# EAGLE design encoder-hex-trigg (EAGLE 9.6.2)
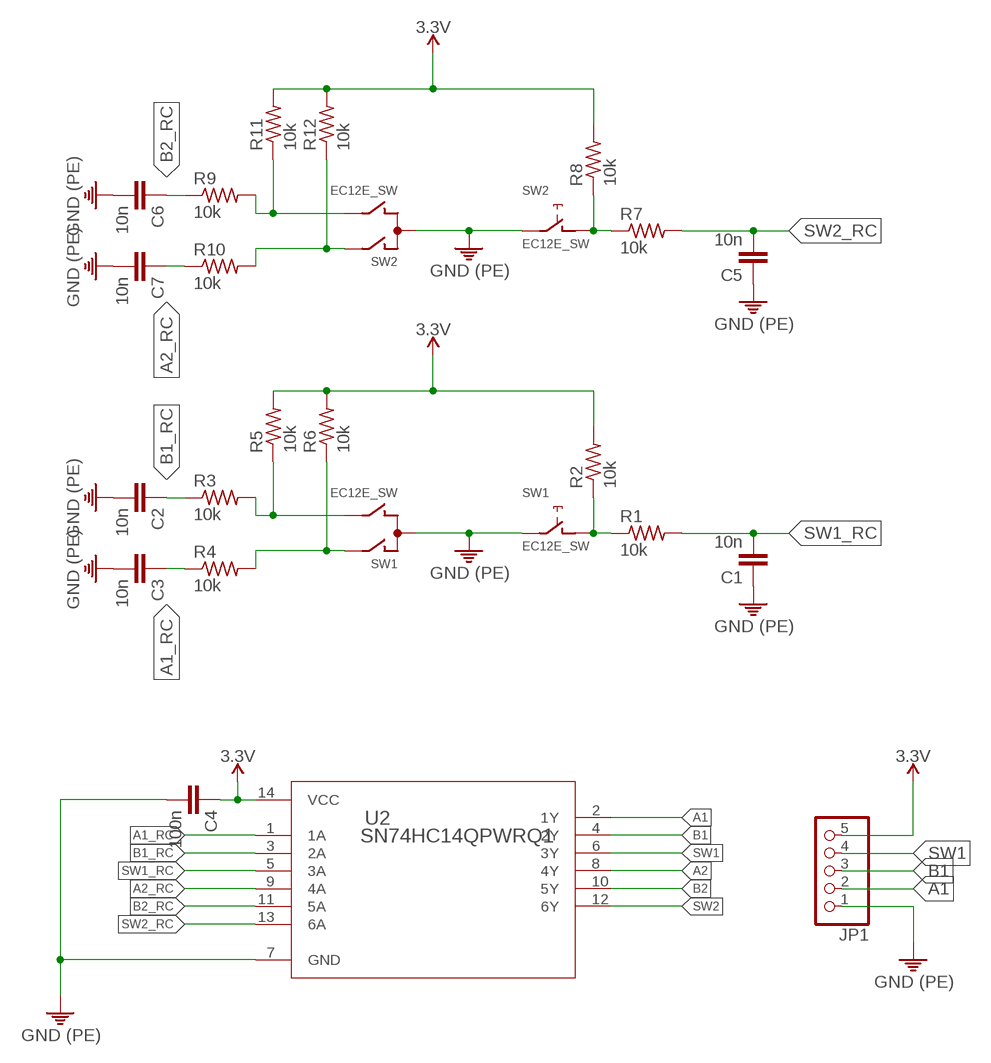
[diagram p0: schematic, sheet 1]

## Parts
C1  10n  C-EUC0603  [C0603]
C2  10n  C-EUC0603  [C0603]
C3  10n  C-EUC0603  [C0603]
C4  100n  C-EUC0603  [C0603]
C5  10n  C-EUC0603  [C0603]
C6  10n  C-EUC0603  [C0603]
C7  10n  C-EUC0603  [C0603]
JP1  PINHD-1X5  [1X05]
R1  10k  R-US_R0603  [R0603]
R2  10k  R-US_R0603  [R0603]
R3  10k  R-US_R0603  [R0603]
R4  10k  R-US_R0603  [R0603]
R5  10k  R-US_R0603  [R0603]
R6  10k  R-US_R0603  [R0603]
R7  10k  R-US_R0603  [R0603]
R8  10k  R-US_R0603  [R0603]
R9  10k  R-US_R0603  [R0603]
R10  10k  R-US_R0603  [R0603]
R11  10k  R-US_R0603  [R0603]
R12  10k  R-US_R0603  [R0603]
SW1  EC12E_SW  [ALPS_EC12E_SW]
SW2  EC12E_SW  [ALPS_EC12E_SW]
U2  SN74HC14QPWRQ1  [PW14]

## Nets
3.3V: C4.1 JP1.5 R2.2 R5.2 R6.2 R8.2 R11.2 R12.2 U2.14(VCC)
A1: JP1.2 U2.2(1Y)
A1_RC: C3.1 R4.1 U2.1(1A)
A2: U2.8(4Y)
A2_RC: C7.1 R10.1 U2.9(4A)
B1: JP1.3 U2.4(2Y)
B1_RC: C2.1 R3.1 U2.3(2A)
B2: U2.10(5Y)
B2_RC: C6.1 R9.1 U2.11(5A)
N$1: R1.1 R2.1 SW1.D
N$2: R7.1 R8.1 SW2.D
N$3: R3.2 R5.1 SW1.B
N$4: R4.2 R6.1 SW1.A
N$5: R9.2 R11.1 SW2.B
N$6: R10.2 R12.1 SW2.A
PE: C1.1 C2.2 C3.2 C4.2 C5.1 C6.2 C7.2 JP1.1 SW1.C SW1.E SW2.C SW2.E U2.7(GND) ; supply symbol labelled POWER-GND
SW1: JP1.4 U2.6(3Y)
SW1_RC: C1.2 R1.2 U2.5(3A)
SW2: U2.12(6Y)
SW2_RC: C5.2 R7.2 U2.13(6A)
Unconnected: SW1.GND1(G) SW1.GND2(G) SW2.GND1(G) SW2.GND2(G)

## Library data of the parts
C1-C7 = rcl:C-EU: CAPACITOR, European symbol; SPICEPREFIX: C
JP1 = pinhead:PINHD-1X5: PIN HEADER
R1-R12 = rcl:R-US_: RESISTOR, American symbol; SPICEPREFIX: R
SW1 SW2 = switch-alps:EC12E_SW: ALPS rotary Encoder EC12E series with switch; MPN: EC12E2424407; OC_FARNELL: 1520813; OC_NEWARK: 74M1068
U2 = SparkFun-PowerSymbols:SN74HC14QPWRQ1; COPYRIGHT: Copyright (C) 2022 Ultra Librarian. All rights reserved.; MANUFACTURER_PART_NUMBER: SN74HC14QPWRQ1; MFR_NAME: Texas Instruments

## Board
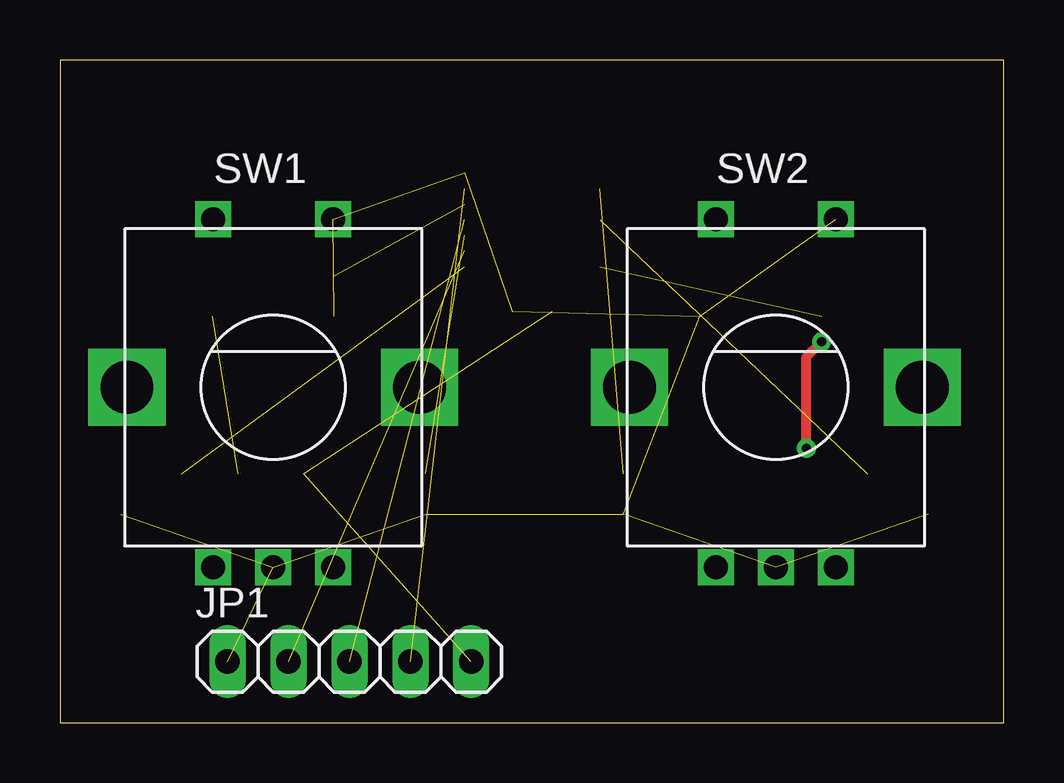
[diagram p1: board, top side]
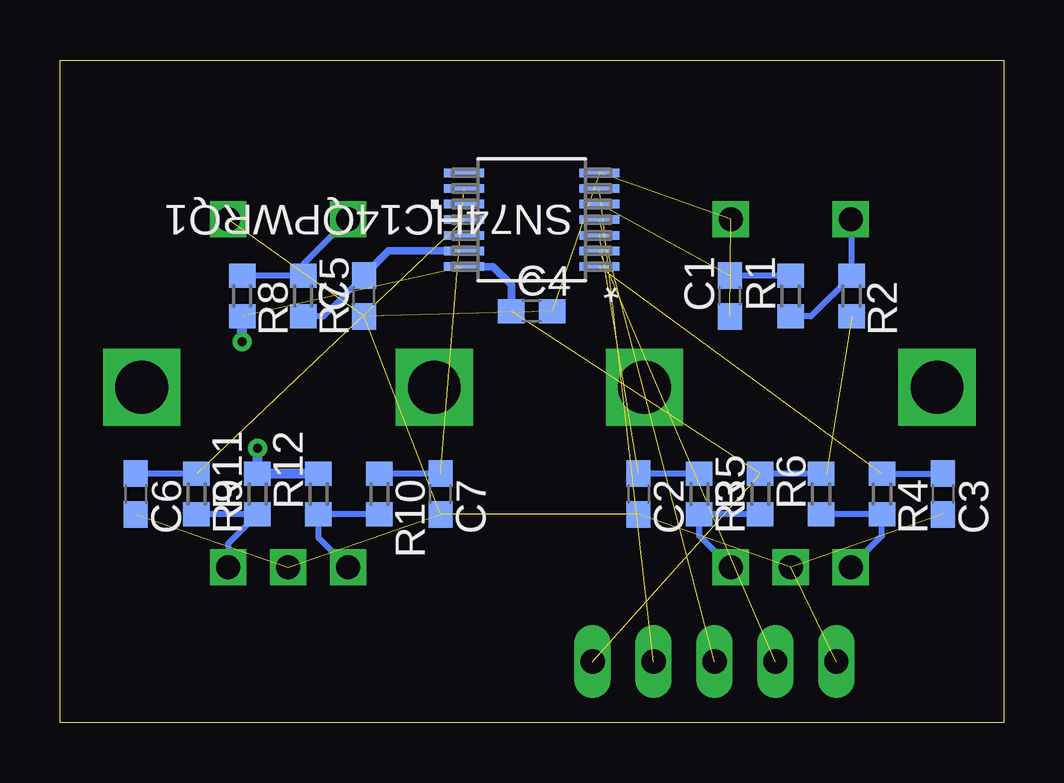
[diagram p2: board, bottom side, seen from below]

Size 39.35 x 27.61 mm. Coordinates in mm from the lower left corner, seen from the top.
Outline: 0,0 39.35,0 39.35,27.61 0,27.61 0,0
Copper layers (1*16): Top 0.035mm / dielectric 1.5mm / Bottom 0.035mm
Design rules "default": minimum track width 6mil, minimum drill 0.35mm, track to track 6mil, track to pad 6mil, pad to pad 6mil, via to via 6mil, smd to smd 6mil, copper to edge 40mil, drill to drill 6mil, minimum pad ring 10mil, minimum via ring 8mil, stop-mask expansion 4mil, vias tented up to drill 0mil, thermal gap 10mil

### Footprints (pad centres in the part's own frame; a part is rotated, then mirrored left to right if it is on the bottom)
C0603 = smd 1.1 x 1: 1 -0.85,0; 2 0.85,0
1X05 = drill 1.016 long: 1 -5.08,0; 2 -2.54,0; 3 0,0; 4 2.54,0; 5 5.08,0
R0603 = smd 1 x 1.1: 1 -0.85,0; 2 0.85,0
ALPS_EC12E_SW = drill 1 square: A -2.5,-7.5; B 2.5,-7.5; C 0,-7.5; D -2.5,7; E 2.5,7 | drill 2.2 square: GND1 -6.1,0; GND2 6.1,0
PW14 = smd 1.676 x 0.356: 1 -2.819,1.95; 2 -2.819,1.3; 3 -2.819,0.65; 4 -2.819,0; 5 -2.819,-0.65; 6 -2.819,-1.3; 7 -2.819,-1.95; 8 2.819,-1.95; 9 2.819,-1.3; 10 2.819,-0.65; 11 2.819,0; 12 2.819,0.65; 13 2.819,1.3; 14 2.819,1.95

### Placement (x,y rotation side)
C1  11.43,17.78 90 bottom
C2  15.24,9.53 270 bottom
C3  2.54,9.53 270 bottom
C4  19.68,17.14 0 bottom
C5  26.67,17.78 90 bottom
C6  36.2,9.53 270 bottom
C7  23.5,9.53 270 bottom
JP1  12.06,2.54 0 top
R1  8.89,17.78 90 bottom
R2  6.35,17.78 270 bottom
R3  12.7,9.53 270 bottom
R4  5.08,9.53 270 bottom
R5  10.16,9.53 90 bottom
R6  7.62,9.53 90 bottom
R7  29.21,17.78 270 bottom
R8  31.75,17.78 270 bottom
R9  33.66,9.53 270 bottom
R10  26.04,9.53 270 bottom
R11  31.11,9.53 90 bottom
R12  28.57,9.53 90 bottom
SW1  8.89,13.97 0 top
SW2  29.84,13.97 0 top
U2  19.68,20.95 180 bottom

### Tracks (layer width: path | path; a pad name or v marks a point on that pad's centre or on a via)
3.3V  (via drill 0.38)  (4 unrouted)
  Top 0.406: v31.11,11.43 31.11,15.24 v31.75,15.88
  Bottom 0.254: R5.2 R6.2 7.41,10.38
  Bottom 0.305: U2.14 21.29,19 20.54,18.25 C4.1
  Bottom 0.406: R12.2 R11.2 v31.11,11.43 | v31.75,15.88 R8.2
A1  (1 unrouted)
A1_RC  (1 unrouted)
  Bottom 0.254: R4.1 C3.1
A2_RC  (1 unrouted)
  Bottom 0.254: C7.1 R10.1
B1  (1 unrouted)
B1_RC  (1 unrouted)
  Bottom 0.254: 12.98,10.65 R3.1 C2.1
B2_RC  (1 unrouted)
  Bottom 0.254: R9.1 C6.1
N$1
  Bottom 0.254: 6.35,21.01 SW1.D 6.35,20.93 R2.1 8.05,16.93 R1.1
N$2
  Bottom 0.254: SW2.D 29.21,19.11 R7.1 R8.1
N$3
  Bottom 0.254: SW1.B 12.7,7.78 12.7,8.26 | 12.7,8.26 R3.2 | R5.1 12.28,8.68 12.7,8.26
N$4
  Bottom 0.254: SW1.A 5.08,7.78 R4.2 R6.1
N$5
  Bottom 0.254: SW2.B 32.34,7.45 R11.1 R9.2
N$6
  Bottom 0.254: R10.2 R12.1 28.57,7.7 SW2.A
PE  (12 unrouted)
SW1  (1 unrouted)
SW1_RC  (1 unrouted)
  Bottom 0.254: R1.2 C1.2
SW2_RC
  Bottom 0.254: C5.2 28.37,16.93 R7.2
  Bottom 0.305: U2.13 25.64,19.66 C5.2